# Altium schematic sheet BURPG_accelerometer_v1.SchDoc
size A
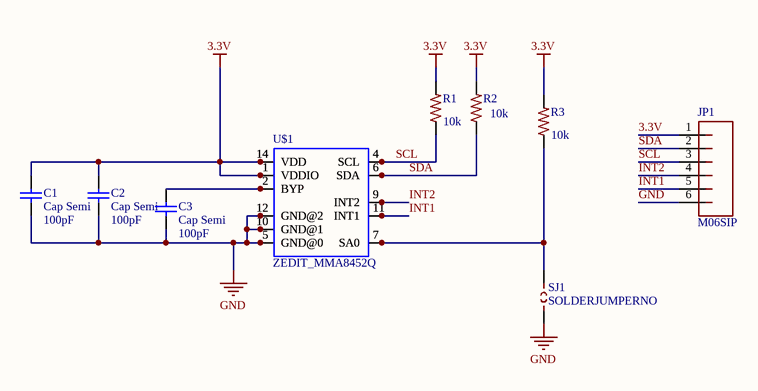
[diagram p0: BURPG_accelerometer_v1.SchDoc]

## Parts
C1  Cap Semi  value 100pF  [1608[0603]]
C2  Cap Semi  value 100pF  [1608[0603]]
C3  Cap Semi  value 100pF  [1608[0603]]
JP1  M06SIP  [1X06]
R1  value 10k  [0603-RES]  (hidden comment: *)
R2  10k  [0603-RES]
R3  10k  [0603-RES]
SJ1  SOLDERJUMPERNO  [SJ_2S-NO]
U$1  ZEDIT_MMA8452Q  [ZEDIT_MMASENSOR]

## Nets
3.3V: C1.2 C2.2 JP1.1 R1.2 R2.2 R3.2 U$1.1(VDDIO) U$1.14(VDD)
GND: C1.1 C2.1 C3.1 JP1.6 SJ1.1 U$1.5(GND@0) U$1.10(GND@1) U$1.12(GND@2)
INT1: JP1.5 U$1.11(INT1)
INT2: JP1.4 U$1.9(INT2)
SCL: JP1.3 R1.1 U$1.4(SCL)
SDA: JP1.2 R2.1 U$1.6(SDA)
NetC3_2: C3.2 U$1.2(BYP)
NetR3_1: R3.1 SJ1.2 U$1.7(SA0)

## Library data of the parts
C1-C3 = Cap Semi: Capacitor (Semiconductor SIM Model); Published: 8-Jun-2000; LatestRevisionDate: 29-May-2009; LatestRevisionNote: IPC-7351 Footprint Added.; PackageReference: C1206; Publisher: Altium Limited; PackageDescription: Chip Capacitor
R1-R3 = 10K-1%RES-00824
  R2 R3: Value: 10k